# Altium project PCB_Project.PrjPcb
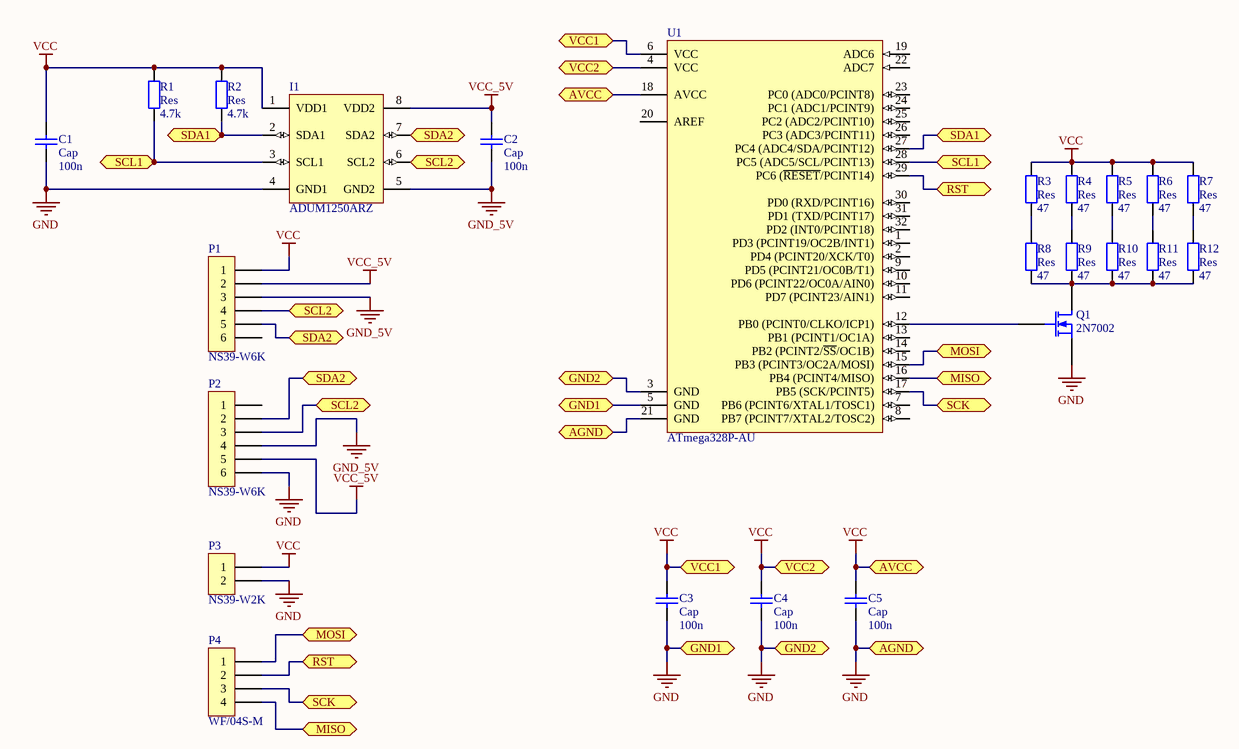
[diagram p0: Sheet1.SchDoc]
2 sheets, 53 parts. Net scope: flat (ports and power ports of the same name join across sheets).
Board file: PCB1.PcbDoc
Sheets:
  Sheet1.SchDoc
  Sheet2.SchDoc

## Sheet Sheet1.SchDoc
size A4

### Parts
C1  Cap  value 100n  [C0805]
C2  Cap  value 100n  [C0805]
C3  Cap  value 100n  [C0805]
C4  Cap  value 100n  [C0805]
C5  Cap  value 100n  [C0805]
I1  ADUM1250ARZ  [SO8_N]
P1  NS39-W6K  [NS39-W6K]
P2  NS39-W6K  [NS39-W6K]
P3  NS39-W2K  [NS39-W2k]
P4  WF/04S-M  [WF/04S-M]
Q1  2N7002  [SOT-23_N]
R1  Res  value 4.7k  [6-0805_N]
R2  Res  value 4.7k  [6-0805_N]
R3  Res  value 47  [6-0805_N]
R4  Res  value 47  [6-0805_N]
R5  Res  value 47  [6-0805_N]
R6  Res  value 47  [6-0805_N]
R7  Res  value 47  [6-0805_N]
R8  Res  value 47  [6-0805_N]
R9  Res  value 47  [6-0805_N]
R10  Res  value 47  [6-0805_N]
R11  Res  value 47  [6-0805_N]
R12  Res  value 47  [6-0805_N]
U1  ATmega328P-AU  [32A_N]

### Ports
AGND, AVCC, GND1, GND2, MISO, MOSI, RST, SCK, SCL1, SCL2, SDA1, SDA2, VCC1, VCC2

### Nets
GND: C1.2 C3.2 C4.2 C5.2 I1.4(GND1) P2.6 P3.2 Q1.2(S) U1.3(GND) U1.5(GND) U1.21(GND) ; port GND2, port GND1, port AGND
GND_5V: C2.2 I1.5(GND2) P1.3 P2.4
VCC: C1.1 C3.1 C4.1 C5.1 I1.1(VDD1) P1.1 P3.1 R1.2 R2.2 R3.2 R4.2 R5.2 R6.2 R7.2 U1.4(VCC) U1.6(VCC) U1.18(AVCC) ; port VCC1, port VCC2, port AVCC
VCC_5V: C2.1 I1.8(VDD2) P1.2 P2.5
NetI1_2: I1.2(SDA1) R2.1 U1.27(PC4_(ADC4/SDA/PCINT12)) ; port SDA1
NetI1_3: I1.3(SCL1) R1.1 U1.28(PC5_(ADC5/SCL/PCINT13)) ; port SCL1
NetI1_6: I1.6(SCL2) P1.4 P2.3 ; port SCL2
NetI1_7: I1.7(SDA2) P1.5 P2.2 ; port SDA2
NetP4_1: P4.1 U1.15(PB3_(PCINT3/OC2A/MOSI)) ; port MOSI
NetP4_2: P4.2 U1.29(PC6_(~{RESET}/PCINT14)) ; port RST
NetP4_3: P4.3 U1.17(PB5_(SCK/PCINT5)) ; port SCK
NetP4_4: P4.4 U1.16(PB4_(PCINT4/MISO)) ; port MISO
NetQ1_1: Q1.1(G) U1.12(PB0_(PCINT0/CLKO/ICP1))
NetQ1_3: Q1.3(D) R8.1 R9.1 R10.1 R11.1 R12.1
NetR3_1: R3.1 R8.2
NetR4_1: R4.1 R9.2
NetR5_1: R5.1 R10.2
NetR6_1: R6.1 R11.2
NetR7_1: R7.1 R12.2

Not connected (* = marked no-connect by the designer): P1 6; P2 1; U1 1(PD3_(PCINT19/OC2B/INT1)) 2(PD4_(PCINT20/XCK/T0)) 7(PB6_(PCINT6/XTAL1/TOSC1)) 8(PB7_(PCINT7/XTAL2/TOSC2)) 9(PD5_(PCINT21/OC0B/T1)) 10(PD6_(PCINT22/OC0A/AIN0)) 11(PD7_(PCINT23/AIN1)) 13(PB1_(PCINT1/OC1A)) 14(PB2_(PCINT2/~{SS}/OC1B)) 19(ADC6) 20(AREF) 22(ADC7) 23(PC0_(ADC0/PCINT8)) 24(PC1_(ADC1/PCINT9)) 25(PC2_(ADC2/PCINT10)) 26(PC3_(ADC3/PCINT11)) 30(PD0_(RXD/PCINT16)) 31(PD1_(TXD/PCINT17)) 32(PD2_(INT0/PCINT18))

### Library data of the parts
C1-C5 = Cap: Capacitor; Published: 8-Jun-2000; LatestRevisionDate: 17-Jul-2002; LatestRevisionNote: Re-released for DXP Platform.; PackageReference: RAD-0.3; Publisher: Altium Limited; PackageDescription: Radial Cap, Thru-Hole; 2 Leads; 0.3 in Pin Spacing
I1 = ADUM1250: Hot Swappable, Dual I2C Isolator
P1 P2 = NS39-W6K: Socket
P3 = NS39-W2K: Socket
P4 = WF/04S-M: Socket
Q1 = MOSFET-N: N-Channel MOSFET; Published: 8-Jun-2000; LatestRevisionDate: 17-Jul-2002; LatestRevisionNote: Re-released for DXP Platform.; PackageVersion: 1995/1996; PackageReference: E3; Publisher: Altium Limited; PackageDescription: TO, Flat Index; 3 In-Line, Axial Leads; Body Dia. 4.6mm; Lead Dia. 0.5 mm (max)
R1-R12 = Res2: Resistor; Published: 8-Jun-2000; LatestRevisionDate: 17-Jul-2002; LatestRevisionNote: Re-released for DXP Platform.; PackageReference: AXIAL-0.4; Publisher: Altium Limited; PackageDescription: Axial Device, Thru-Hole; 2 Leads; 0.4 in Pin Spacing
U1 = ATmega328P-AU: 8-bit AVR Microcontroller, 32KB Flash, 1KB EEPROM, 2KB SRAM, 32-pin TQFP, Industrial Grade (-40°C to 85°C); Published: 1-Apr-2010; DatasheetVersion: revA, Jan-2010; PackageVersion: revB, Oct-2001; PackageReference: 32A; Publisher: Altium Limited; PackageDescription: 32-Lead, 7x7x1.0 mm Body, 0.8mm Lead Pitch, Thin Profile Plastic Quad Flat Package (TQFP); Supplier 1: Digi-Key; Supplier Part Number 1: ATMEGA328P-AU-ND; Supplier 2: Farnell; Supplier Part Number 2: 1715486; Supplier 3: Mouser; Supplier Part Number 3: 556-ATMEGA328P-AU; Code_JEDEC: MS-026-ABA; ComponentLink1Description: Manufacturer Link; ComponentLink1URL: http://www.atmel.com/products/avr/default.asp?; ComponentLink2Description: ATmega48A/48PA/88A/88PA/168A/168PA/328/328P Datasheet; ComponentLink2URL: http://www.atmel.com/dyn/resources/prod_documents/8271.pdf; ComponentLink3Description: ATmega48A/48PA/88A/88PA/168A/168PA/328/328P Summary; ComponentLink3URL: http://www.atmel.com/dyn/resources/prod_documents/8271S.pdf; ComponentLink4Description: Atmel.com Home; ComponentLink4URL: http://www.atmel.com

## Sheet Sheet2.SchDoc
size A4
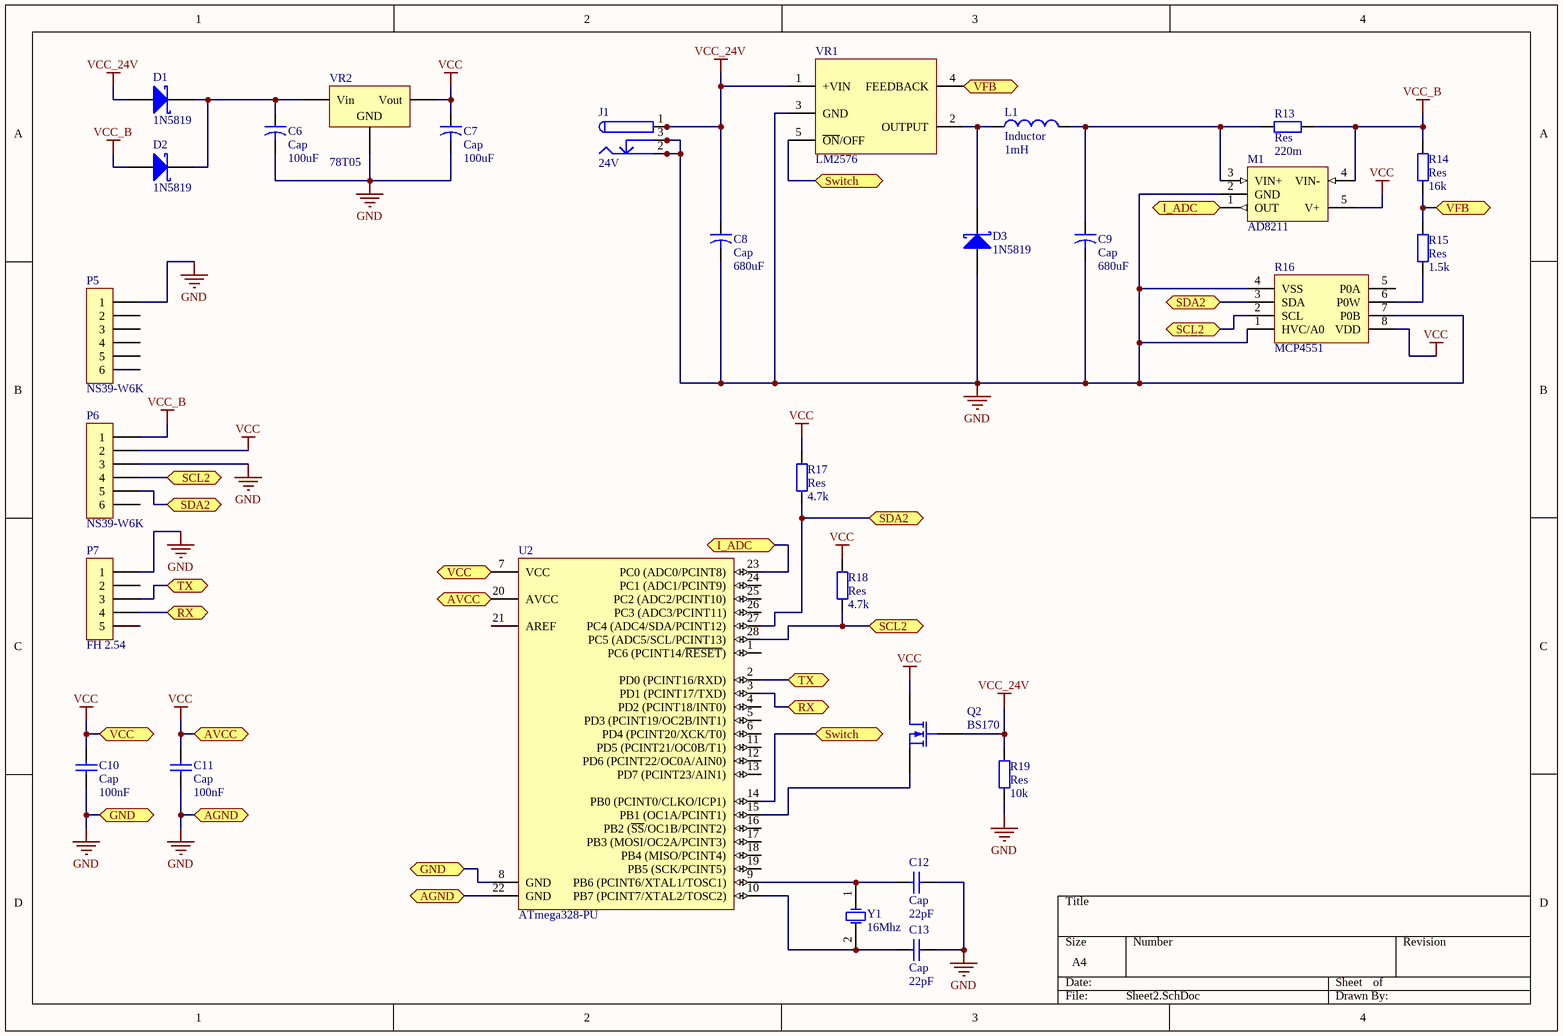
[diagram p1: Sheet2.SchDoc]

### Parts
C6  Cap  value 100uF  [CAPR5-4X5]
C7  Cap  value 100uF  [CAPR5-4X5]
C8  Cap  value 680uF  [CAPR5-4X5]
C9  Cap  value 680uF  [CAPR5-4X5]
C10  Cap  value 100nF  [C0805]
C11  Cap  value 100nF  [C0805]
C12  Cap  value 22pF  [C0805]
C13  Cap  value 22pF  [C0805]
D1  1N5819  [SOT-23_N]
D2  1N5819  [SOT-23_N]
D3  1N5819  [SOT-23_N]
J1  24V  [KLD-0202]
L1  Inductor  value 1mH  [0402-A]
M1  AD8211
P5  NS39-W6K  [NS39-W6K]
P6  NS39-W6K  [NS39-W6K]
P7  FH 2.54
Q2  BS170  [E3]
R13  Res  value 220m  [6-0805_N]
R14  Res  value 16k  [6-0805_N]
R15  Res  value 1.5k  [6-0805_N]
R16  MCP4551
R17  Res  value 4.7k  [6-0805_N]
R18  Res  value 4.7k  [6-0805_N]
R19  Res  value 10k  [6-0805_N]
U2  ATmega328-PU  [28P3]
VR1  LM2576
VR2  78T05  [TO-220AB]
Y1  16Mhz  [R38]

### Ports
AGND, AVCC, GND, I_ADC, RX, SCL2, SDA2, Switch, TX, VCC, VFB

### Nets
GND: C6.2 C7.2 C8.2 C9.2 C10.2 C11.2 C12.2 C13.2 D3.1(A) J1.2 J1.2A J1.2B J1.3 J1.3A J1.3B M1.2(GND) P5.1 P6.3 P7.1 R16.1(HVC/A0) R16.4(VSS) R16.7(P0B) R19.1 U2.8(GND) U2.22(GND) VR1.3(GND) VR2.2(GND) ; port GND, port AGND
VCC: C7.1 C10.1 C11.1 M1.5(V+) P6.2 Q2.1(D) R16.8(VDD) R17.2 R18.2 U2.7(VCC) U2.20(AVCC) VR2.3(Vout) ; port VCC, port AVCC
VCC_24V: C8.1 D1.1(A) J1.1 J1.1A J1.1B Q2.2(G) R19.2 VR1.1(+VIN)
VCC_B: D2.1(A) M1.4(VIN-) P6.1 R13.1 R14.2
NetC6_1: C6.1 D1.3(K) D2.3(K) VR2.1(Vin)
NetC9_1: C9.1 L1.2 M1.3(VIN+) R13.2
NetC12_1: C12.1 U2.9(PB6_(PCINT6/XTAL1/TOSC1)) Y1.1(OSC1)
NetC13_1: C13.1 U2.10(PB7_(PCINT7/XTAL2/TOSC2)) Y1.2(OSC2)
NetD3_3: D3.3(K) L1.1 VR1.2(OUTPUT)
NetI1_6: P6.4 R16.2(SCL) R18.1 U2.28(PC5_(ADC5/SCL/PCINT13)) ; port SCL2
NetI1_7: P6.5 R16.3(SDA) R17.1 U2.27(PC4_(ADC4/SDA/PCINT12)) ; port SDA2
NetM1_1: M1.1(OUT) U2.23(PC0_(ADC0/PCINT8)) ; port I_ADC
NetP7_3: P7.3 U2.2(PD0_(PCINT16/RXD)) ; port TX
NetP7_4: P7.4 U2.3(PD1_(PCINT17/TXD)) ; port RX
NetQ2_3: Q2.3(S) U2.15(PB1_(OC1A/PCINT1))
NetR14_1: R14.1 R15.2 VR1.4(FEEDBACK) ; port VFB
NetR15_1: R15.1 R16.6(P0W)
NetU2_14: U2.14(PB0_(PCINT0/CLKO/ICP1)) VR1.5(~{ON}/OFF) ; port Switch

Not connected (* = marked no-connect by the designer): P5 2 3 4 5 6; P6 6; P7 2 5; R16 5(P0A); U2 1(PC6_(PCINT14/~{RESET})) 4(PD2_(PCINT18/INT0)) 5(PD3_(PCINT19/OC2B/INT1)) 6(PD4_(PCINT20/XCK/T0)) 11(PD5_(PCINT21/OC0B/T1)) 12(PD6_(PCINT22/OC0A/AIN0)) 13(PD7_(PCINT23/AIN1)) 16(PB2_(~{SS}/OC1B/PCINT2)) 17(PB3_(MOSI/OC2A/PCINT3)) 18(PB4_(MISO/PCINT4)) 19(PB5_(SCK/PCINT5)) 21(AREF) 24(PC1_(ADC1/PCINT9)) 25(PC2_(ADC2/PCINT10)) 26(PC3_(ADC3/PCINT11))

### Library data of the parts
C6-C9 = Cap2: Capacitor; Published: 23-Sep-2002; PackageReference: CAPR5-4X5; Publisher: Altium Limited; PackageDescription: Capacitor; 2 Leads
C10-C13 = Cap: Capacitor; Published: 8-Jun-2000; LatestRevisionDate: 17-Jul-2002; LatestRevisionNote: Re-released for DXP Platform.; PackageReference: RAD-0.3; Publisher: Altium Limited; PackageDescription: Radial Cap, Thru-Hole; 2 Leads; 0.3 in Pin Spacing
D1-D3 = Diode BAT17: Silicon RF Schottky Diode for Mixer Applications in the VHF/UHF Range; Note: Pin 2 is not connected and not drawn.; Published: 21-Mar-2003; LatestRevisionDate: 29-May-2009; LatestRevisionNote: IPC-7351 Footprint Added.; DatasheetVersion: Oct-1999; PackageVersion: Sep-2001; PackageReference: SOT-23; Publisher: Altium Limited; PackageDescription: 3-Pin SOT-23 Package 0.95 mm Pitch, 2.5 mm Lead Span; ComponentLink1Description: Manufacturer Link; ComponentLink1URL: http://www.infineon.com/; ComponentLink2Description: Datasheet; ComponentLink2URL: http://www.infineon.com/upload/Document/cmc_upload/documents/009/363/bat17series.pdf
J1 = PWR2.5: Low Voltage Power Supply Connector; Published: 17-Dec-2003; DatasheetDocument: 09-May-2002; Publisher: Altium Limited; ComponentLink1Description: Manufacturer Link; ComponentLink1URL: http://domino.kycon.com/internet/Products.html
L1 = Inductor: Code_IEC: 1005; Published: 8-Jun-2000; LatestRevisionDate: 29-May-2009; LatestRevisionNote: IPC-7351 Footprint Added.; PackageReference: 0402-A; Publisher: Altium Limited; PackageDescription: Chip Inductor; Code_JEITA: 0402
M1 = AD8211: Current Shunt Monitor
P5 P6 = NS39-W6K: Socket
P7 = FH 2.54: Socket
Q2 = MOSFET-N: N-Channel MOSFET; Published: 8-Jun-2000; LatestRevisionDate: 17-Jul-2002; LatestRevisionNote: Re-released for DXP Platform.; PackageVersion: 1995/1996; PackageReference: E3; Publisher: Altium Limited; PackageDescription: TO, Flat Index; 3 In-Line, Axial Leads; Body Dia. 4.6mm; Lead Dia. 0.5 mm (max)
R13-R15 R17-R19 = Res2: Resistor; Published: 8-Jun-2000; LatestRevisionDate: 17-Jul-2002; LatestRevisionNote: Re-released for DXP Platform.; PackageReference: AXIAL-0.4; Publisher: Altium Limited; PackageDescription: Axial Device, Thru-Hole; 2 Leads; 0.4 in Pin Spacing
R16 = MCP4551: Digital POT
U2 = ATmega328-PU: 8-bit AVR Microcontroller, 32KB Flash, 1KB EEPROM, 2KB SRAM, 28-pin PDIP, Industrial Grade (-40°C to 85°C); Published: 1-Apr-2010; DatasheetVersion: revA, Jan-2010; PackageVersion: revB, Sep-2001; PackageReference: 28P3; Publisher: Altium Limited; PackageDescription: 28-lead (0.300"/7.62mm Wide) Plastic Dual Inline Package (PDIP); Supplier 1: Digi-Key; Supplier Part Number 1: ATMEGA328-PU-ND; Supplier 2: Mouser; Supplier Part Number 2: 556-ATMEGA328-PU; ComponentLink1Description: Manufacturer Link; ComponentLink1URL: http://www.atmel.com/products/avr/default.asp?; ComponentLink2Description: ATmega48A/48PA/88A/88PA/168A/168PA/328/328P Datasheet; ComponentLink2URL: http://www.atmel.com/dyn/resources/prod_documents/8271.pdf; ComponentLink3Description: ATmega48A/48PA/88A/88PA/168A/168PA/328/328P Summary; ComponentLink3URL: http://www.atmel.com/dyn/resources/prod_documents/8271S.pdf; ComponentLink4Description: Atmel.com Home; ComponentLink4URL: http://www.atmel.com
VR1 = LM2576: Step-Down Voltage Regulator
VR2 = Volt Reg: Voltage Regulator; Published: 24-Mar-1999; LatestRevisionDate: 29-May-2009; LatestRevisionNote: IPC-7351 Footprint Added.; PackageReference: D2PAK; Publisher: Altium Limited; PackageDescription: 3-Pin Transistor Outline Package 2.54 mm Pitch, 15.1 mm Lead Span
Y1 = XTAL: Crystal Oscillator; Published: 8-Jun-2000; LatestRevisionDate: 17-Jul-2002; LatestRevisionNote: Re-released for DXP Platform.; PackageReference: R38; Publisher: Altium Limited; PackageDescription: Crystal, Thru-Hole; 2 Leads; Body 3.1 x 8.2 mm (Dia.xH)

## Nets that join several sheets
GND: Sheet1 (11 pins), Sheet2 (27 pins)
VCC: Sheet1 (17 pins), Sheet2 (12 pins)
NetI1_6: Sheet1 (I1.6 P1.4 P2.3), Sheet2 (P6.4 R16.2 R18.1 U2.28)
NetI1_7: Sheet1 (I1.7 P1.5 P2.2), Sheet2 (P6.5 R16.3 R17.1 U2.27)